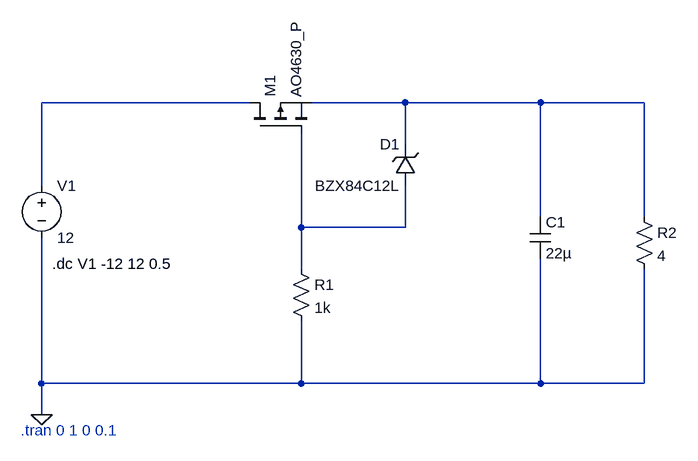
[diagram p0: schematic LizardBot1_ControlBoard_SPICE_CircuitProtection.asc]
LizardBot1_ControlBoard_SPICE_CircuitProtection.asc, the LTspice schematic file:
Version 4
SHEET 1 880 680
WIRE -80 96 -400 96
WIRE 160 96 16 96
WIRE 368 96 160 96
WIRE 528 96 368 96
WIRE 160 160 160 96
WIRE -400 224 -400 96
WIRE 368 272 368 96
WIRE 528 272 528 96
WIRE 0 288 0 144
WIRE 160 288 160 224
WIRE 160 288 0 288
WIRE 0 352 0 288
WIRE -400 528 -400 304
WIRE 0 528 0 432
WIRE 0 528 -400 528
WIRE 368 528 368 336
WIRE 368 528 0 528
WIRE 528 528 528 352
WIRE 528 528 368 528
WIRE -400 576 -400 528
FLAG -400 576 0
SYMBOL voltage -400 208 R0
WINDOW 123 0 0 Left 0
WINDOW 39 0 0 Left 0
SYMATTR InstName V1
SYMATTR Value 12
SYMBOL pmos -80 144 R270
SYMATTR InstName M1
SYMATTR Value AO4630_P
SYMBOL zener 176 224 R180
WINDOW 0 24 64 Left 2
WINDOW 3 24 0 Left 2
SYMATTR InstName D1
SYMATTR Value BZX84C12L
SYMBOL res -16 336 R0
SYMATTR InstName R1
SYMATTR Value 1k
SYMBOL res 512 256 R0
SYMATTR InstName R2
SYMATTR Value 4
SYMBOL cap 352 272 R0
SYMATTR InstName C1
SYMATTR Value 22µ
SYMATTR SpiceLine V=35 Irms=1.63 Rser=0.07 Lser=0 mfg="Vishay" pn="T55V226M035" type="Tantalum Polymer"
TEXT -432 600 Left 2 ;.tran 0 1 0 0.1
TEXT -384 344 Left 2 !.dc V1 -12 12 0.5

The netlist it stands for:
* LizardBot1_ControlBoard_SPICE_CircuitProtection.asc
V1 N001 0 12
M1 N001 N003 N002 N002 AO4630_P
D1 N003 N002 BZX84C12L
R1 N003 0 1k
R2 N002 0 4
C1 N002 0 22µ V=35 Irms=1.63 Rser=0.07 Lser=0 mfg="Vishay" pn="T55V226M035" type="Tantalum Polymer"
.model D D
.lib standard.dio
.model NMOS NMOS
.model PMOS PMOS
.lib standard.mos
* .tran 0 1 0 0.1
.dc V1 -12 12 0.5
.backanno
.end